# EAGLE design ds3232-breakout (EAGLE 5.10)
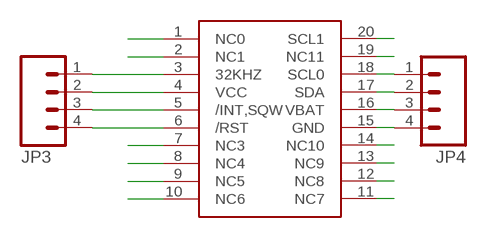
[diagram p0: schematic, sheet 1]

## Parts
JP3  M04LOCK_LONGPADS  [1X04_LOCK_LONGPADS]
JP4  M04LOCK_LONGPADS  [1X04_LOCK_LONGPADS]
U$1  DS3232  [SO20W]

## Nets
32KHZ: JP3.1 U$1.3(32KHZ)
GND: JP4.4 U$1.1(NC0) U$1.2(NC1) U$1.7(NC3) U$1.8(NC4) U$1.9(NC5) U$1.10(NC6) U$1.11(NC7) U$1.12(NC8) U$1.13(NC9) U$1.14(NC10) U$1.15(GND) U$1.19(NC11)
INT: JP3.3 U$1.5(/INT,SQW)
RST: JP3.4 U$1.6(/RST)
SCL: JP4.1 U$1.18(SCL0) U$1.20(SCL1)
SDA: JP4.2 U$1.17(SDA)
VBAT: JP4.3 U$1.16(VBAT)
VCC: JP3.2 U$1.4(VCC)

## Library data of the parts
JP3 JP4 = SparkFun:M04: Header 4 Standard 4-pin 0.1" header. Use with straight break away headers (SKU : PRT-00116), right angle break away headers (PRT-00553), swiss pins (PRT-00743), machine pins (PRT-00117), and female headers (PRT-00115). Molex polarized connector foot print use with SKU : PRT-08231 with associated crimp pins and housings.
U$1 = ideabot:DS3232

## Board
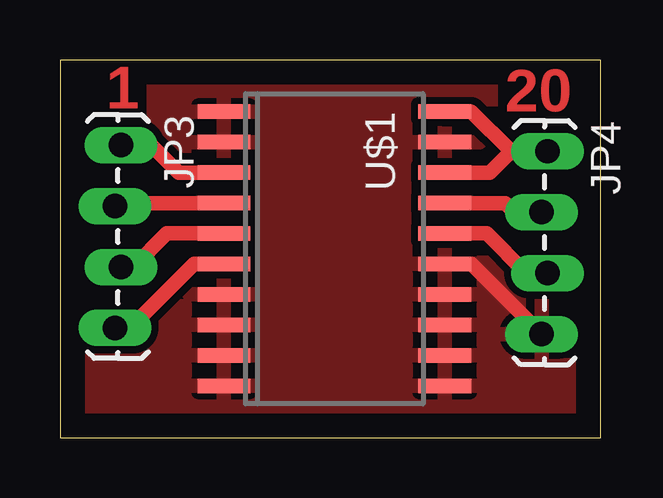
[diagram p1: board, top side]

Size 22.53 x 15.74 mm. Coordinates in mm from the lower left corner, seen from the top.
Outline: 0,0 22.53,0 22.53,15.74 0,15.74 0,0
Copper layers (1*16): Top 0.035mm / dielectric 1.5mm / Bottom 0.035mm
Design rules "default": minimum track width 10mil, minimum drill 24mil, track to track 8mil, track to pad 8mil, pad to pad 8mil, via to via 8mil, smd to smd 8mil, copper to edge 40mil, drill to drill 8mil, minimum pad ring 10mil, minimum via ring 8mil, stop-mask expansion 4mil, vias tented up to drill 0mil, thermal gap 10mil

### Footprints (pad centres in the part's own frame; a part is rotated, then mirrored left to right if it is on the bottom)
1X04_LOCK_LONGPADS = drill 1.016 long: 1 0,0; 2 2.54,-0.254; 3 5.08,0; 4 7.62,-0.254
SO20W = smd 0.6 x 2.2: 1 -5.715,-4.6; 2 -4.445,-4.6; 3 -3.175,-4.6; 4 -1.905,-4.6; 5 -0.635,-4.6; 6 0.635,-4.6; 7 1.905,-4.6; 8 3.175,-4.6; 9 4.445,-4.6; 10 5.715,-4.6; 11 5.715,4.6; 12 4.445,4.6; 13 3.175,4.6; 14 1.905,4.6; 15 0.635,4.6; 16 -0.635,4.6; 17 -1.905,4.6; 18 -3.175,4.6; 19 -4.445,4.6; 20 -5.715,4.6

### Placement (x,y rotation side)
JP3  2.54,12.19 270 top
JP4  20.32,11.94 270 top
U$1  11.43,7.87 270 top

### Tracks (layer width: path | path; a pad name or v marks a point on that pad's centre or on a via)
32KHZ
  Top 0.61: JP3.1 3.81,12.19 4.95,11.05 U$1.3
GND
  Top 0.61: JP4.4 17.14,7.24 16.13,7.24 U$1.15
  pour Top (isolate 0.305): 0.38,15.37 0.38,0.38 22.1,0.38 22.1,15.37
INT
  Top 0.61: JP3.3 3.05,7.11 4.45,8.51 U$1.5
RST
  Top 0.61: JP3.4 2.92,4.57 5.59,7.24 U$1.6
SCL
  Top 0.61: 18.8,11.94 JP4.1 | 18.8,11.94 17.91,11.05 U$1.18 | U$1.20 17.14,13.59 18.8,11.94
SDA
  Top 0.61: JP4.2 18.92,9.4 18.54,9.78 U$1.17
VBAT
  Top 0.61: JP4.3 19.43,6.86 17.78,8.51 U$1.16
VCC
  Top 0.61: JP3.2 3.05,9.65 3.18,9.78 U$1.4

### Text on the board
Top: 1 | 20